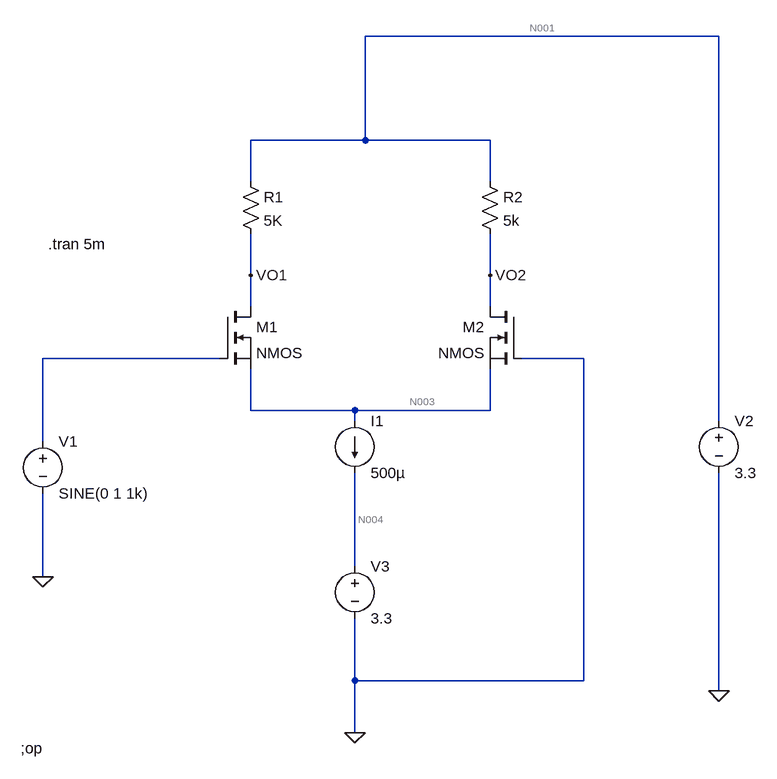
[diagram p0: schematic Draft6.asc]
Draft6.asc, the LTspice schematic file:
Version 4
SHEET 1 880 1000
WIRE 784 -112 240 -112
WIRE 240 48 240 -112
WIRE 240 48 64 48
WIRE 432 48 240 48
WIRE 64 112 64 48
WIRE 432 112 432 48
WIRE 64 256 64 192
WIRE 432 256 432 192
WIRE 64 304 64 256
WIRE 432 304 432 256
WIRE 16 384 -256 384
WIRE 576 384 480 384
WIRE 64 464 64 400
WIRE 224 464 64 464
WIRE 432 464 432 400
WIRE 432 464 224 464
WIRE 224 480 224 464
WIRE 784 480 784 -112
WIRE -256 512 -256 384
WIRE 224 704 224 560
WIRE -256 720 -256 592
WIRE 224 880 224 784
WIRE 576 880 576 384
WIRE 576 880 224 880
WIRE 784 896 784 560
WIRE 224 960 224 880
FLAG -256 720 0
FLAG 224 960 0
FLAG 784 896 0
FLAG 64 256 VO1
FLAG 432 256 VO2
SYMBOL res 48 96 R0
SYMATTR InstName R1
SYMATTR Value 5K
SYMBOL res 416 96 R0
SYMATTR InstName R2
SYMATTR Value 5k
SYMBOL nmos 16 304 R0
SYMATTR InstName M1
SYMBOL nmos 480 304 M0
SYMATTR InstName M2
SYMBOL voltage -256 496 R0
WINDOW 123 0 0 Left 0
WINDOW 39 0 0 Left 0
SYMATTR InstName V1
SYMATTR Value SINE(0 1 1k)
SYMBOL voltage 784 464 R0
WINDOW 123 0 0 Left 0
WINDOW 39 0 0 Left 0
SYMATTR InstName V2
SYMATTR Value 3.3
SYMBOL voltage 224 688 R0
WINDOW 123 0 0 Left 0
WINDOW 39 0 0 Left 0
SYMATTR InstName V3
SYMATTR Value 3.3
SYMBOL current 224 480 R0
WINDOW 123 0 0 Left 0
WINDOW 39 0 0 Left 0
SYMATTR InstName I1
SYMATTR Value 500µ
TEXT -290 984 Left 2 !;op
TEXT -248 208 Left 2 !.tran 5m

The netlist it stands for:
* Draft6.asc
R1 N001 VO1 5K
R2 N001 VO2 5k
M1 VO1 N002 N003 N003 NMOS
M2 VO2 0 N003 N003 NMOS
V1 N002 0 SINE(0 1 1k)
V2 N001 0 3.3
V3 N004 0 3.3
I1 N003 N004 500µ
.model NMOS NMOS
.model PMOS PMOS
.lib standard.mos
;op
.tran 5m
.backanno
.end

* Results of the author's LTspice run, read from the files saved beside the schematic
* Operating Point, zero values left out:
*   V(n001) = 3.3 V
*   V(vo1) = 2.05 V
*   V(vo2) = 2.05 V
*   V(n003) = -5 V
*   V(n004) = 3.3 V
*   Id(M1) = 250 µA
*   Ib(M1) = -7.06 pA
*   Is(M1) = -250 µA
*   Id(M2) = 250 µA
*   Ib(M2) = -7.06 pA
*   Is(M2) = -250 µA
*   I(I1) = 500 µA
*   I(R1) = 250 µA
*   I(R2) = 250 µA
*   I(V2) = -500 µA
*   I(V3) = 500 µA
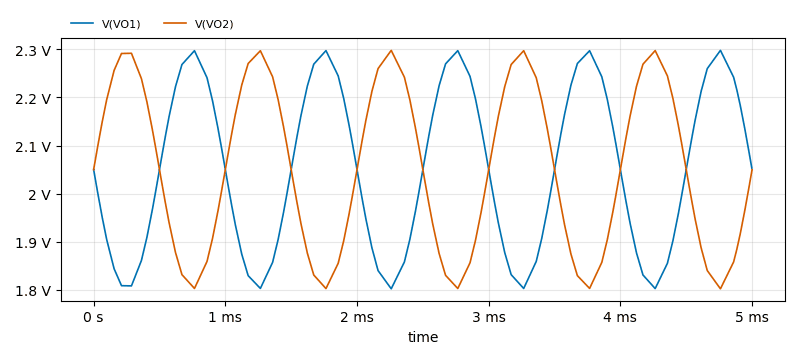
[diagram p1: Transient Analysis of Draft6.asc, plotted from the saved traces]
* Transient Analysis, 1 run:
*   V(VO1): min 1.802 V, max 2.298 V, average 2.05 V, rms 2.057 V, last 2.05 V
*   V(VO2): min 1.802 V, max 2.298 V, average 2.05 V, rms 2.057 V, last 2.05 V